# Altium schematic sheet clock_12MHz.SchDoc
size A4; SheetNumber: 8; SheetTotal: 10
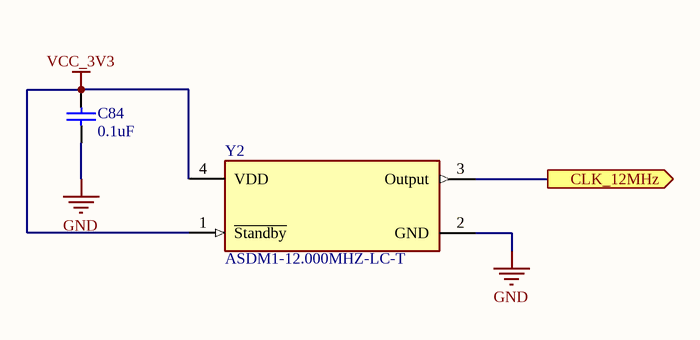
[diagram p0: clock_12MHz.SchDoc]

## Parts
C84  0.1uF  [0805_C_S]
Y2  ASDM1-12.000MHZ-LC-T  [FP-ASDM-ASDMB-MFG]

## Ports
CLK_12MHz (out)

## Nets
GND: C84.1 Y2.2(GND)
VCC_3V3: C84.2 Y2.1(~{Standby}) Y2.4(VDD)
CLK_12MHz: Y2.3(Output) ; port CLK_12MHz

## Library data of the parts
C84 = Cap: Capacitor; Published: 8-Jun-2000; LatestRevisionDate: 17-Jul-2002; LatestRevisionNote: Re-released for DXP Platform.; Publisher: Altium Limited; Value: 0.1uF
Y2 = CMP-27762-002611-1: MEMS Oscillator 12MHz ±50ppm LVCMOS 3.3V SMD 2.5x2mm; Load Capacitance: 15pF; Min Supply Voltage: 3V; Max Supply Voltage: 3.6V; Max Supply Current: 10mA; Length: 0.098inch; Operating Supply Voltage: 3.3V; Number of Pins: 4; Packaging: Tape and Reel; Height: 0.035inch; Width: 0.079inch; Mount: Surface Mount; Case/Package: SMD/SMT; Series: Pure Silicon™ ASDM; Lead Free: Lead Free; Frequency: 12MHz; Max Operating Temperature: 85°C; RoHS Compliant: Yes; Package Quantity: 1000; Min Operating Temperature: -40°C; Operating Frequency: 12 MHz; Termination: SMD/SMT; Frequency Stability: 50ppm